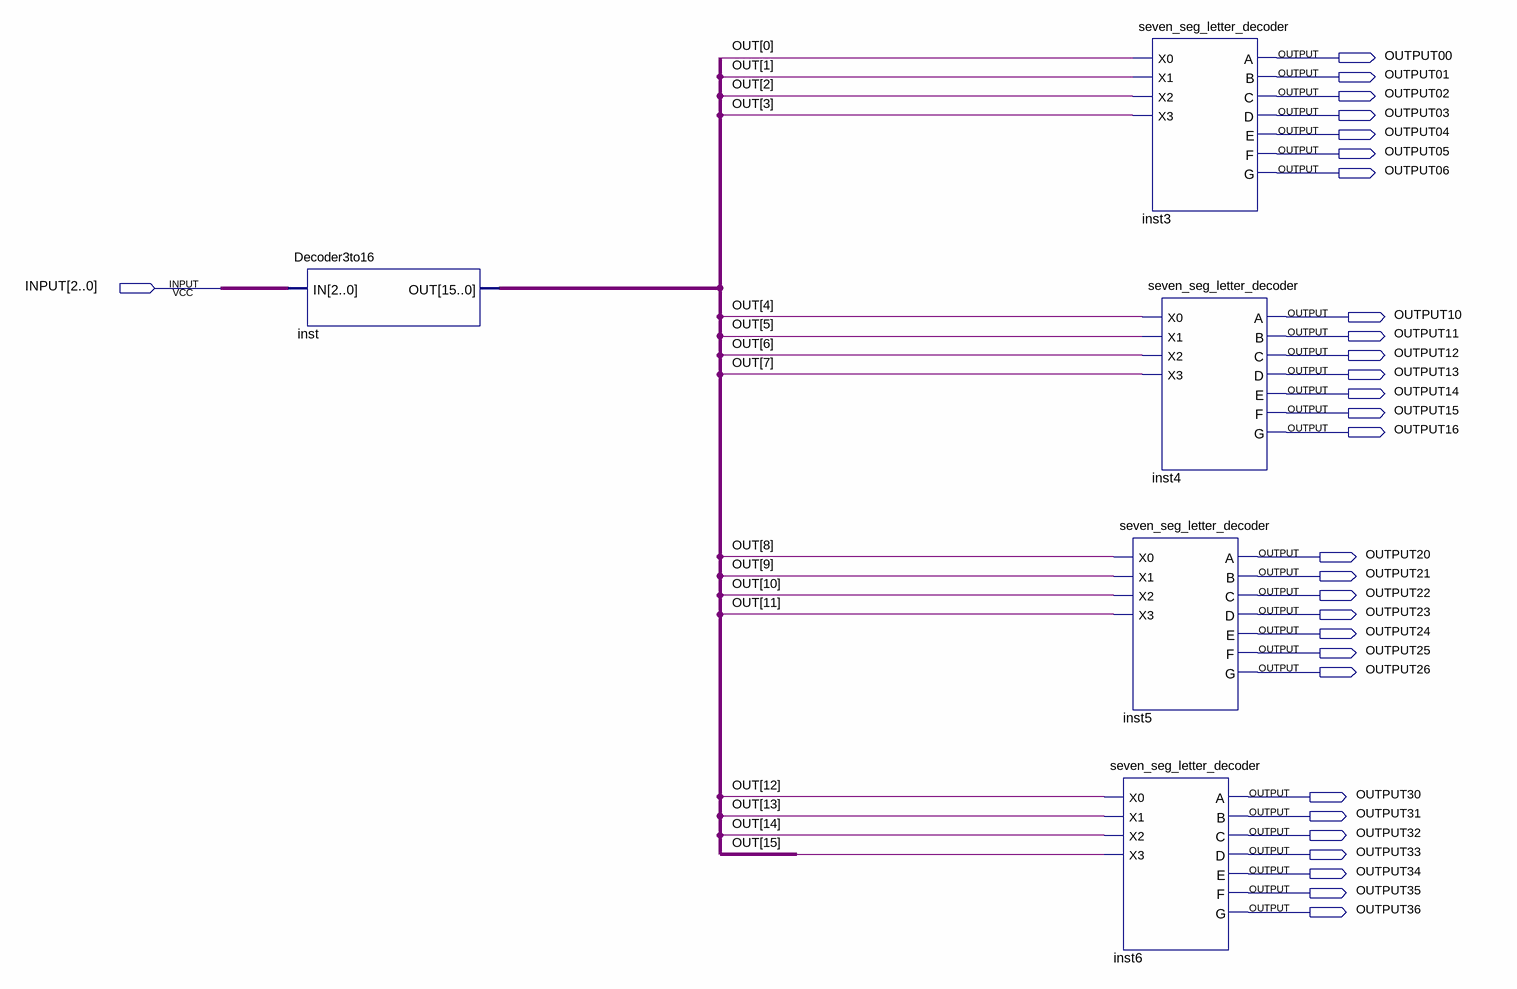
[diagram p0: schematic sheet]
// Quartus schematic letter7SegOutput.bdf as structural Verilog: 5 symbols, 29 pins
module letter7SegOutput (
  input  [2:0] INPUT,
  output OUTPUT00,
  output OUTPUT01,
  output OUTPUT02,
  output OUTPUT03,
  output OUTPUT04,
  output OUTPUT05,
  output OUTPUT06,
  output OUTPUT10,
  output OUTPUT11,
  output OUTPUT12,
  output OUTPUT13,
  output OUTPUT14,
  output OUTPUT15,
  output OUTPUT16,
  output OUTPUT20,
  output OUTPUT21,
  output OUTPUT22,
  output OUTPUT23,
  output OUTPUT24,
  output OUTPUT25,
  output OUTPUT26,
  output OUTPUT30,
  output OUTPUT31,
  output OUTPUT32,
  output OUTPUT33,
  output OUTPUT34,
  output OUTPUT35,
  output OUTPUT36
);

  wire [15:0] inst_out, OUT;

  Decoder3to16 inst (.IN(INPUT), .OUT(inst_out));
  seven_seg_letter_decoder inst3 (
    .X0(OUT[0]), .X1(OUT[1]), .X2(OUT[2]), .X3(OUT[3]), .A(OUTPUT00), .B(OUTPUT01), .C(OUTPUT02),
    .D(OUTPUT03), .E(OUTPUT04), .F(OUTPUT05), .G(OUTPUT06));
  seven_seg_letter_decoder inst4 (
    .X0(OUT[4]), .X1(OUT[5]), .X2(OUT[6]), .X3(OUT[7]), .A(OUTPUT10), .B(OUTPUT11), .C(OUTPUT12),
    .D(OUTPUT13), .E(OUTPUT14), .F(OUTPUT15), .G(OUTPUT16));
  seven_seg_letter_decoder inst5 (
    .X0(OUT[8]), .X1(OUT[9]), .X2(OUT[10]), .X3(OUT[11]), .A(OUTPUT20), .B(OUTPUT21), .C(OUTPUT22),
    .D(OUTPUT23), .E(OUTPUT24), .F(OUTPUT25), .G(OUTPUT26));
  seven_seg_letter_decoder inst6 (
    .X0(OUT[12]), .X1(OUT[13]), .X2(OUT[14]), .X3(OUT[15]), .A(OUTPUT30), .B(OUTPUT31), .C(OUTPUT32),
    .D(OUTPUT33), .E(OUTPUT34), .F(OUTPUT35), .G(OUTPUT36));
endmodule
